# Altium project ADIO_Ver1.2.PrjPCB
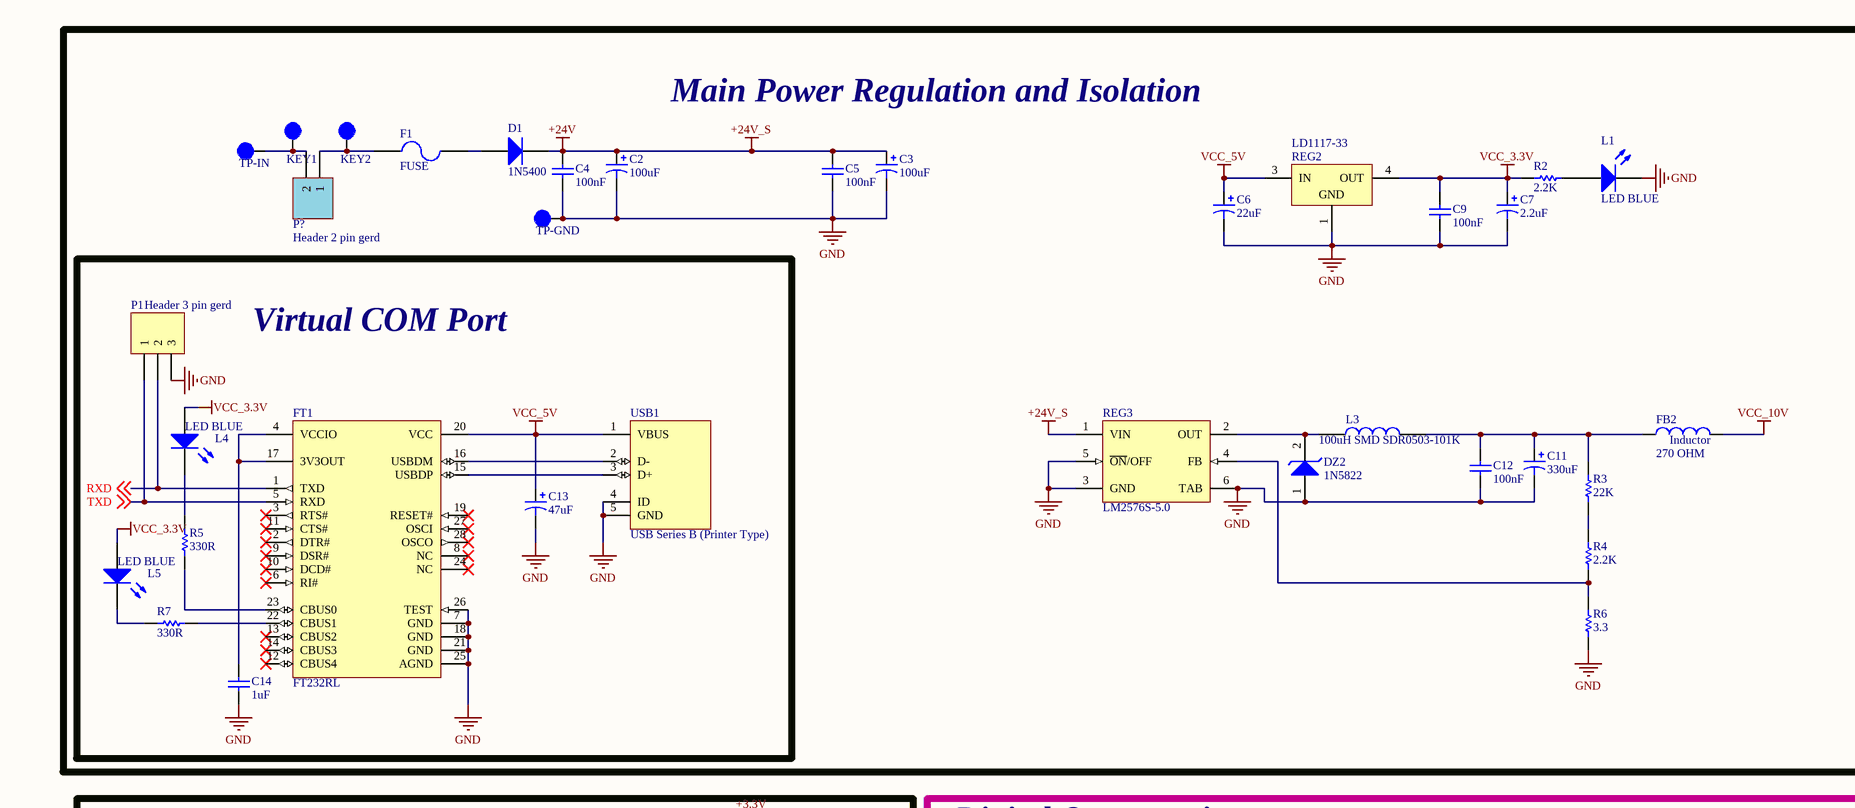
[diagram p0: ADIO_Ver1.2.SchDoc, top left]
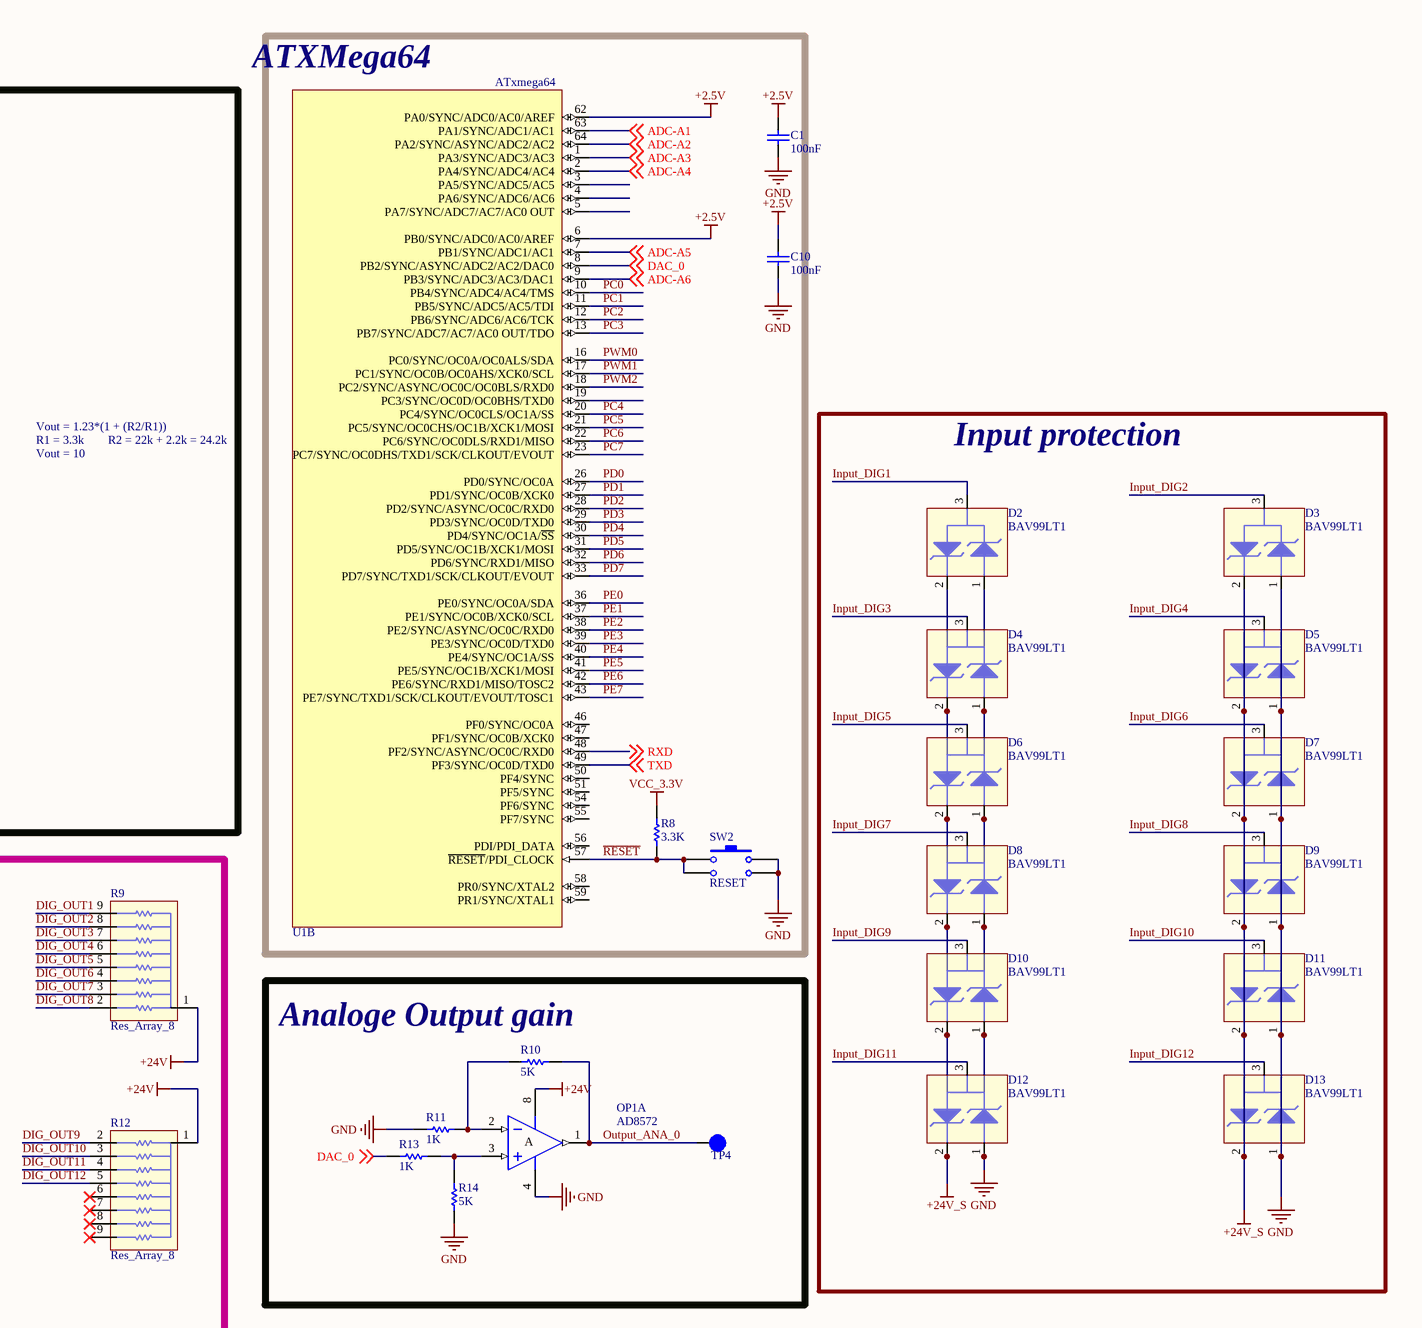
[diagram p1: ADIO_Ver1.2.SchDoc, top right]
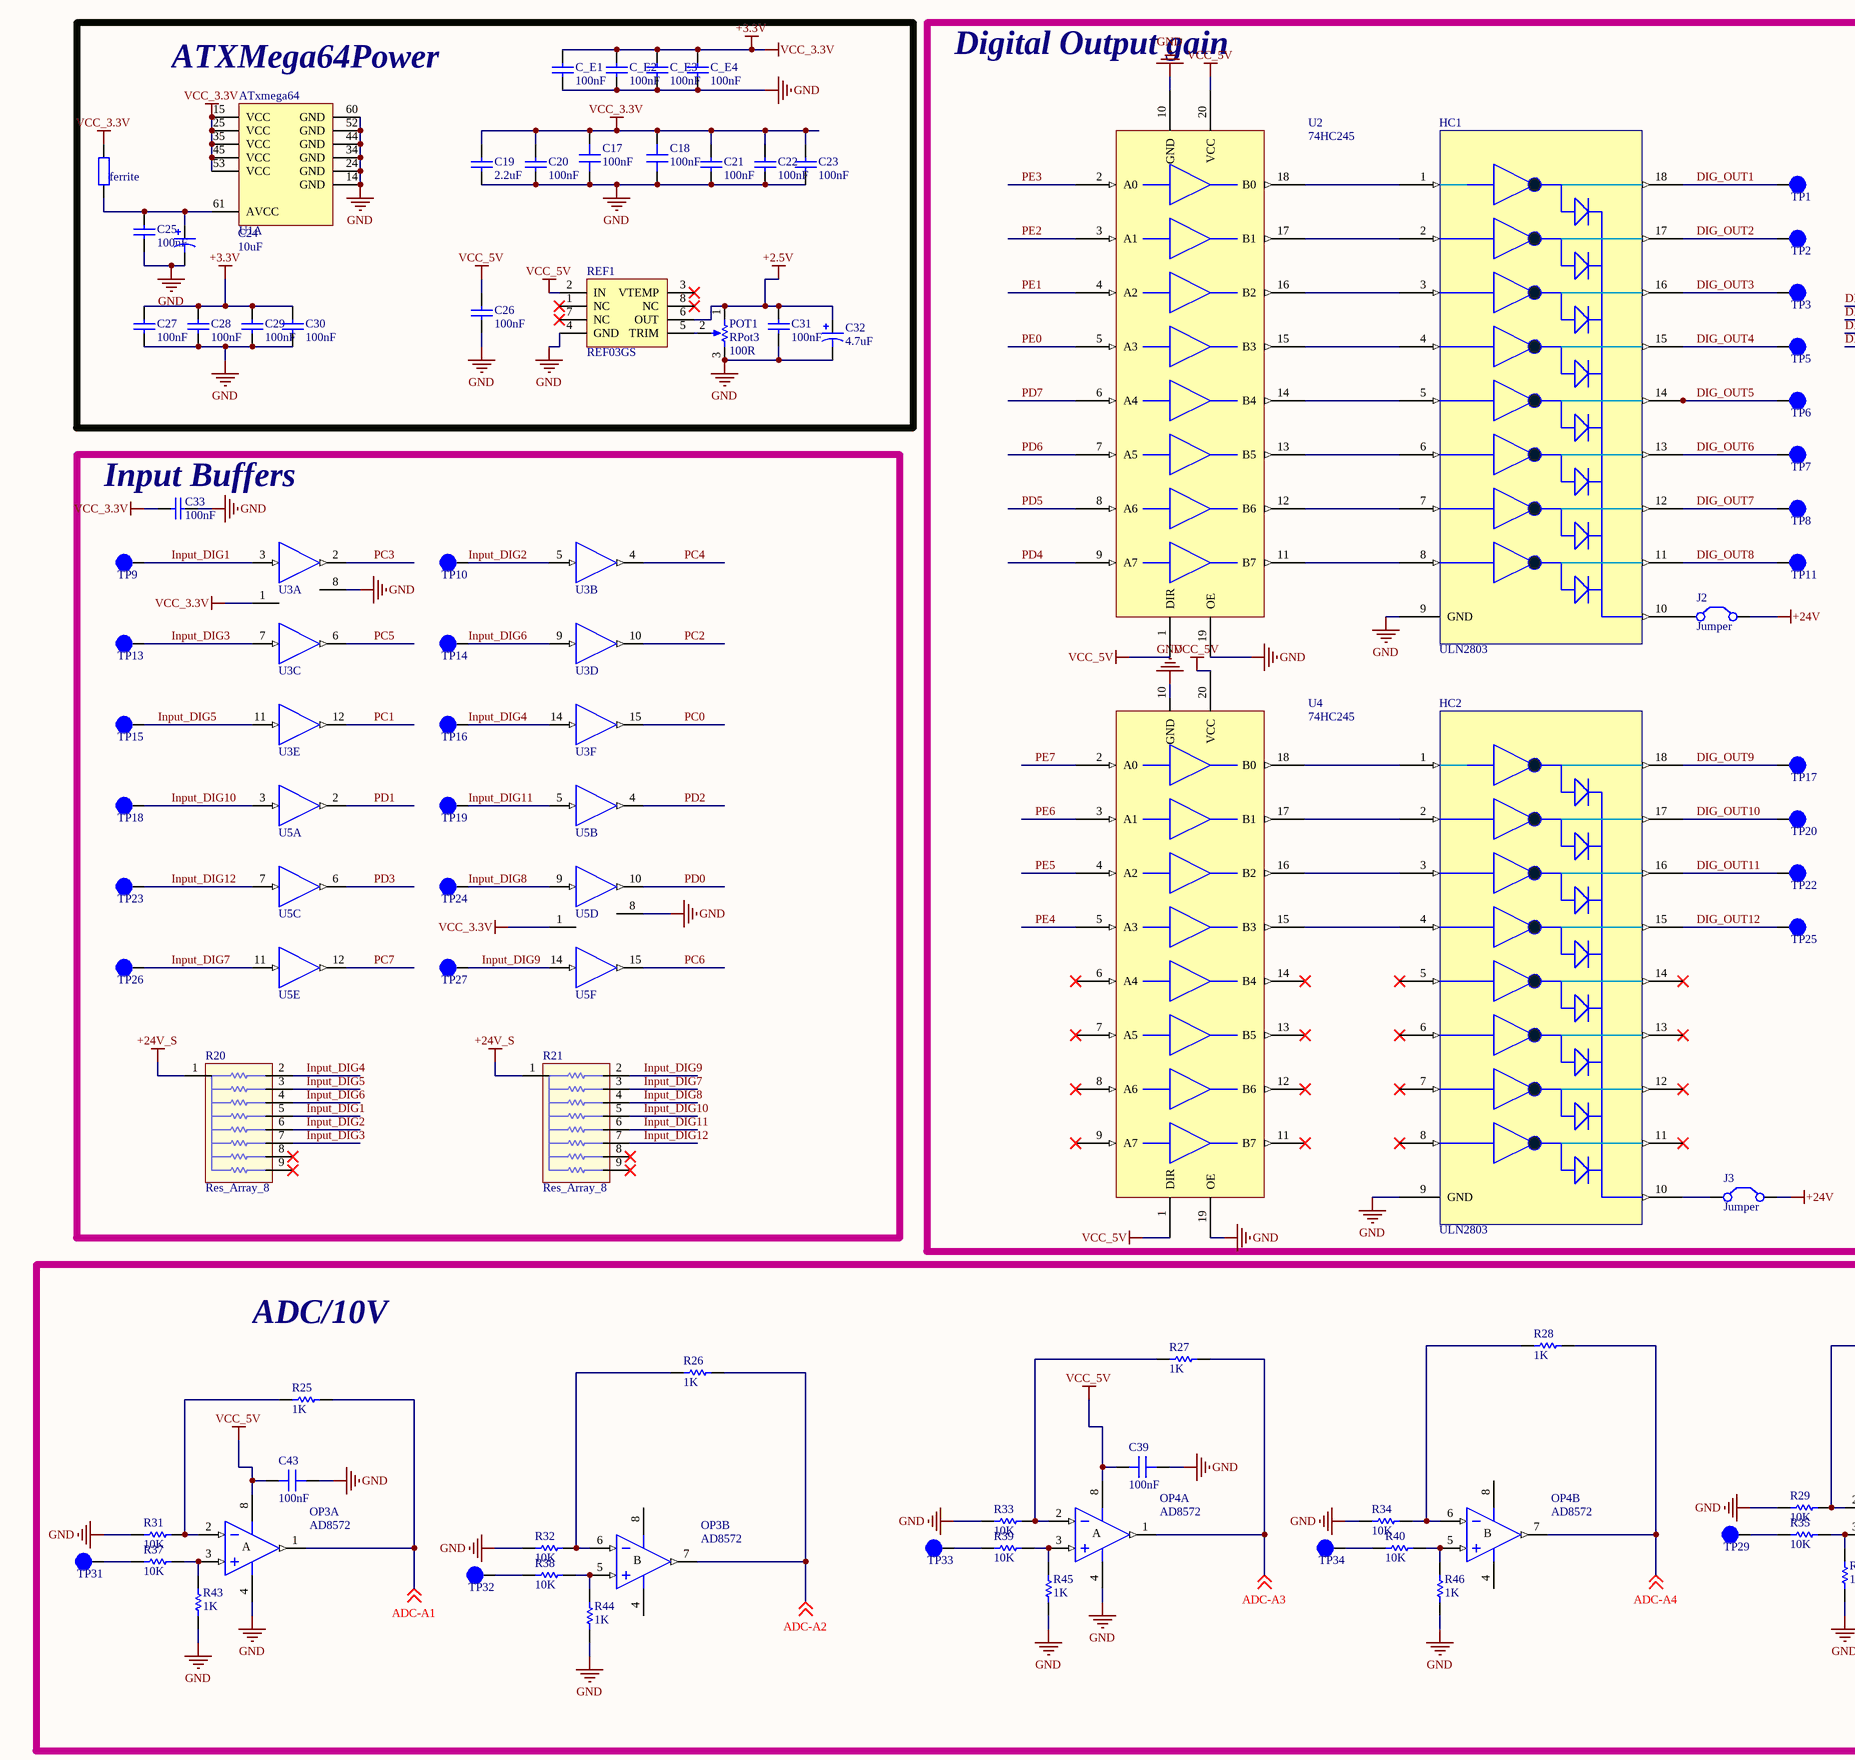
[diagram p2: ADIO_Ver1.2.SchDoc, bottom left]
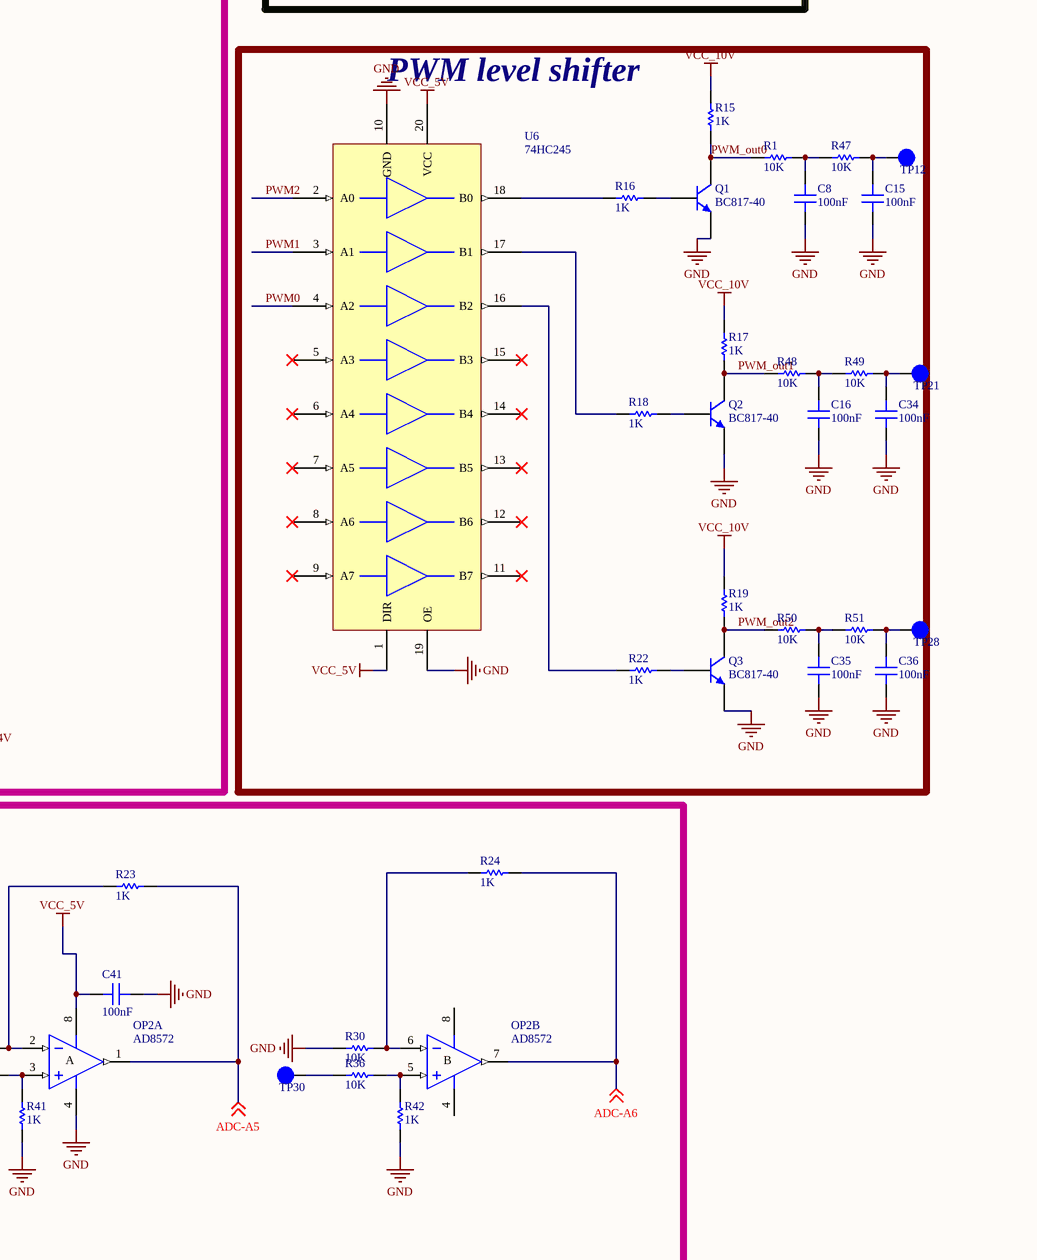
[diagram p3: ADIO_Ver1.2.SchDoc, bottom right]
1 sheet, 179 parts. Net scope: global (net labels, ports and power ports of the same name join across sheets).
Board file: ADIO_Ver1.2.PcbDoc

## Sheet ADIO_Ver1.2.SchDoc
size 635 x 508 mm

### Parts
C1  100nF  [C805]
C2  100uF  [CAP 5x10.5]
C3  100uF  [CAP 5x10.5]
C4  100nF  [C805]
C5  100nF  [C805]
C6  22uF  [CAP 5x10.5]
C7  2.2uF  [CAPMOL-A]
C8  100nF  [C1206]
C9  100nF  [C805]
C10  100nF  [C805]
C11  330uF  [CAP 5x10.5]
C12  100nF  [C805]
C13  47uF  [CAPMOL-B]
C14  1uF  [C805]
C15  100nF  [C1206]
C16  100nF  [C1206]
C17  100nF  [C0805]
C18  100nF  [C0805]
C19  2.2uF  [C805]
C20  100nF  [C805]
C21  100nF  [C805]
C22  100nF  [C805]
C23  100nF  [C805]
C24  10uF  [CAPMOL-B]
C25  100nF  [C805]
C26  100nF  [C805]
C27  100nF  [C805]
C28  100nF  [C805]
C29  100nF  [C805]
C30  100nF  [C805]
C31  100nF  [C805]
C32  4.7uF  [CAPMOL-B]
C33  100nF  [C0805]
C34  100nF  [C1206]
C35  100nF  [C1206]
C36  100nF  [C1206]
C39  100nF  [C0805]
C41  100nF  [C0805]
C43  100nF  [C0805]
C_E1  100nF  [C805]
C_E2  100nF  [C805]
C_E3  100nF  [C805]
C_E4  100nF  [C805]
D1  1N5400  [MDO-201AD]
D2  BAV99LT1  [MSOT-23]
D3  BAV99LT1  [MSOT-23]
D4  BAV99LT1  [MSOT-23]
D5  BAV99LT1  [MSOT-23]
D6  BAV99LT1  [MSOT-23]
D7  BAV99LT1  [MSOT-23]
D8  BAV99LT1  [MSOT-23]
D9  BAV99LT1  [MSOT-23]
D10  BAV99LT1  [MSOT-23]
D11  BAV99LT1  [MSOT-23]
D12  BAV99LT1  [MSOT-23]
D13  BAV99LT1  [MSOT-23]
DZ2  1N5822  [DIODE-SMC]
F1  FUSE  [FUSE_3]
FB2  Inductor  value 270 OHM  [AXIAL-0.3]
FT1  FT232RL  [MSSOP-28]
HC1  ULN2803  [ULN2803]
HC2  ULN2803  [ULN2803]
J2  Jumper  [MRAD-0.1]
J3  Jumper  [MRAD-0.1]
KEY1  VREF  [Test-Pin]  (value not drawn)
KEY2  VREF  [Test-Pin]  (value not drawn)
L1  LED BLUE  [LED 0805]
L3  100uH SMD SDR0503-101K  [Inductor SMD Power 100UH]
L4  LED BLUE  [LED 0805]
L5  LED BLUE  [LED 0805]
OP1  AD8572  [SO8_N]  (part A of 2)
OP2  AD8572  [SO8_N]  (parts A,B of 2)
OP3  AD8572  [SO8_N]  (parts A,B of 2)
OP4  AD8572  [SO8_N]  (parts A,B of 2)
P1  Header 3 pin gerd  [SPOX-3]
P?  Header 2 pin gerd  [SPOX-2]
POT1  RPot3  value 100R  [VR5]
Q1  BC817-40  [MSOT-23]
Q2  BC817-40  [MSOT-23]
Q3  BC817-40  [MSOT-23]
R1  10K  [R0805]
R2  2.2K  [R0805]
R3  22K  [R0805]
R4  2.2K  [R0805]
R5  330R  [R0805]
R6  3.3  [R0805]
R7  330R  [R0805]
R8  3.3K  [R0805]
R9  Res_Array_8  [RES_ARRAY8]
R10  5K  [R0805]
R11  1K  [R0805]
R12  Res_Array_8  [RES_ARRAY8]
R13  1K  [R0805]
R14  5K  [R0805]
R15  1K  [R0805]
R16  1K  [R0805]
R17  1K  [R0805]
R18  1K  [R0805]
R19  1K  [R0805]
R20  Res_Array_8  [RES_ARRAY8]
R21  Res_Array_8  [RES_ARRAY8]
R22  1K  [R0805]
R23  1K  [R0805]
R24  1K  [R0805]
R25  1K  [R0805]
R26  1K  [R0805]
R27  1K  [R0805]
R28  1K  [R0805]
R29  10K  [R0805]
R30  10K  [R0805]
R31  10K  [R0805]
R32  10K  [R0805]
R33  10K  [R0805]
R34  10K  [R0805]
R35  10K  [R0805]
R36  10K  [R0805]
R37  10K  [R0805]
R38  10K  [R0805]
R39  10K  [R0805]
R40  10K  [R0805]
R41  1K  [R0805]
R42  1K  [R0805]
R43  1K  [R0805]
R44  1K  [R0805]
R45  1K  [R0805]
R46  1K  [R0805]
R47  10K  [R0805]
R48  10K  [R0805]
R49  10K  [R0805]
R50  10K  [R0805]
R51  10K  [R0805]
R_ferrit1  value ferrite  [R1206]  (hidden comment: Res2)
REF1  REF03GS  [SO8_N]
REG2  LD1117-33  [MDPAK-TO-252]
REG3  LM2576S-5.0  [MTO-263]
SW2  RESET  [SW_SMD]
TP1  TP_ADIO  [test_point_ADIO]  (value not drawn)
TP2  TP_ADIO  [test_point_ADIO]  (value not drawn)
TP3  TP_ADIO  [test_point_ADIO]  (value not drawn)
TP4  TP_ADIO  [test_point_ADIO]  (value not drawn)
TP5  TP_ADIO  [test_point_ADIO]  (value not drawn)
TP6  TP_ADIO  [test_point_ADIO]  (value not drawn)
TP7  TP_ADIO  [test_point_ADIO]  (value not drawn)
TP8  TP_ADIO  [test_point_ADIO]  (value not drawn)
TP9  TP_ADIO  [test_point_ADIO]  (value not drawn)
TP10  TP_ADIO  [test_point_ADIO]  (value not drawn)
TP11  TP_ADIO  [test_point_ADIO]  (value not drawn)
TP12  TP_ADIO  [test_point_ADIO]  (value not drawn)
TP13  TP_ADIO  [test_point_ADIO]  (value not drawn)
TP14  TP_ADIO  [test_point_ADIO]  (value not drawn)
TP15  TP_ADIO  [test_point_ADIO]  (value not drawn)
TP16  TP_ADIO  [test_point_ADIO]  (value not drawn)
TP17  TP_ADIO  [test_point_ADIO]  (value not drawn)
TP18  TP_ADIO  [test_point_ADIO]  (value not drawn)
TP19  TP_ADIO  [test_point_ADIO]  (value not drawn)
TP20  TP_ADIO  [test_point_ADIO]  (value not drawn)
TP21  TP_ADIO  [test_point_ADIO]  (value not drawn)
TP22  TP_ADIO  [test_point_ADIO]  (value not drawn)
TP23  TP_ADIO  [test_point_ADIO]  (value not drawn)
TP24  TP_ADIO  [test_point_ADIO]  (value not drawn)
TP25  TP_ADIO  [test_point_ADIO]  (value not drawn)
TP26  TP_ADIO  [test_point_ADIO]  (value not drawn)
TP27  TP_ADIO  [test_point_ADIO]  (value not drawn)
TP28  TP_ADIO  [test_point_ADIO]  (value not drawn)
TP29  TP_ADIO  [test_point_ADIO]  (value not drawn)
TP30  TP_ADIO  [test_point_ADIO]  (value not drawn)
TP31  TP_ADIO  [test_point_ADIO]  (value not drawn)
TP32  TP_ADIO  [test_point_ADIO]  (value not drawn)
TP33  TP_ADIO  [test_point_ADIO]  (value not drawn)
TP34  TP_ADIO  [test_point_ADIO]  (value not drawn)
TP-GND  TP_ADIO  [test_point_ADIO]  (value not drawn)
TP-IN  TP_ADIO  [test_point_ADIO]  (value not drawn)
U1  ATxmega64  [MTQFP64]  (parts A,B of 2)
U2  74HC245  [D020_N]
U3  MC74HC4050D  [751B-05_N]  (value not drawn)  (parts A,B,C,D,E,F of 6)
U4  74HC245  [D020_N]
U5  MC74HC4050D  [751B-05_N]  (value not drawn)  (parts A,B,C,D,E,F of 6)
U6  74HC245  [D020_N]
USB1  USB Series B (Printer Type)  [USB-B]

### Blocks framed on the sheet
Main Power Regulation and Isolation: C2-C7 C9 C11 C12 D1 DZ2 F1 FB2 KEY1 KEY2 L1 L3 P? R2-R4 R6 REG2 REG3 TP-GND TP-IN
Virtual COM Port: C13 C14 FT1 L4 L5 P1 R5 R7 USB1
Input protection: D2-D13
ATXMega64Power: C17-C32 C_E1-C_E4 POT1 R_ferrit1 REF1 U1
Digital Output gain: HC1 HC2 J2 J3 R9 R12 TP1-TP3 TP5-TP8 TP11 TP17 TP20 TP22 TP25 U2 U4
Analoge Output gain: OP1 R10 R11 R13 R14 TP4
Input Buffers: C33 R20 R21 TP9 TP10 TP13-TP16 TP18 TP19 TP23 TP24 TP26 TP27 U3 U5
PWM level shifter: C8 C15 C16 C34-C36 Q1-Q3 R1 R15-R19 R22 R47-R51 TP12 TP21 TP28 U6
ADC/10V: C39 C41 C43 OP2-OP4 R23-R46 TP29-TP34

### Nets
+2.5V: C1.2 C10.2 C31.2 C32.1 POT1.1(TOP) REF1.6(OUT) U1.6(PB0/SYNC/ADC0/AC0/AREF) U1.62(PA0/SYNC/ADC0/AC0/AREF)
+3.3V: C7.1 C9.2 C17.2 C18.2 C19.2 C20.2 C21.2 C22.2 C23.2 C27.2 C28.2 C29.2 C30.2 C33.1 C_E1.2 C_E2.2 C_E3.2 C_E4.2 L4.1(A) L5.1(A) R2.1 R8.2 R_ferrit1.2 REG2.4(OUT) U1.15(VCC) U1.25(VCC) U1.35(VCC) U1.45(VCC) U1.53(VCC) U3.1(VDD) U5.1(VDD)  [also labelled VCC_3.3V]
+24V: C2.1 C3.1 C4.2 C5.2 D1.2(K) D2.2 D3.2 D4.2 D5.2 D6.2 D7.2 D8.2 D9.2 D10.2 D11.2 D12.2 D13.2 J2.2(C2) J3.2(C2) OP1.8(V+) R9.1 R12.1 R20.1 R21.1 REG3.1(VIN)  [also labelled +24V_S]
GND: C1.1 C2.2 C3.2 C4.1 C5.1 C6.2 C7.2 C8.1 C9.1 C10.1 C11.2 C12.1 C13.2 C14.1 C15.1 C16.1 C17.1 C18.1 C19.1 C20.1 C21.1 C22.1 C23.1 C24.2 C25.1 C26.1 C27.1 C28.1 C29.1 C30.1 C31.1 C32.2 C33.2 C34.1 C35.1 C36.1 C39.2 C41.2 C43.2 C_E1.1 C_E2.1 C_E3.1 C_E4.1 D2.1 D3.1 D4.1 D5.1 D6.1 D7.1 D8.1 D9.1 D10.1 D11.1 D12.1 D13.1 DZ2.1(A) FT1.7(GND) FT1.18(GND) FT1.21(GND) FT1.25(AGND) FT1.26(TEST) HC1.9(GND) HC2.9(GND) L1.2(K) OP1.4(V-) OP2.4(V-) OP3.4(V-) OP4.4(V-) P1.3 POT1.3(BOT) Q1.2(E) Q2.2(E) Q3.2(E) R6.2 R11.1 R14.1 R29.1 R30.1 R31.1 R32.1 R33.1 R34.1 R41.1 R42.1 R43.1 R44.1 R45.1 R46.1 REF1.4(GND) REG2.1(GND) REG3.3(GND) REG3.5(~{ON}/OFF) REG3.6(TAB) SW2.2 SW2.4 TP-GND.1 U1.14(GND) U1.24(GND) U1.34(GND) U1.44(GND) U1.52(GND) U1.60(GND) U2.10(GND) U2.19(OE) U3.8(GND) U4.19(OE) U5.8(GND) U6.10(GND) U6.19(OE) USB1.4(ID) USB1.5(GND)
VCC_5V: C6.1 C13.1 C26.2 C39.1 C41.1 C43.1 FT1.20(VCC) OP2.8(V+) OP3.8(V+) OP4.8(V+) REF1.2(IN) REG2.3(IN) U2.1(DIR) U2.20(VCC) U4.1(DIR) U4.20(VCC) U6.1(DIR) U6.20(VCC) USB1.1(VBUS)
VCC_10V: FB2.2 R15.1 R17.1 R19.1
ADC-A1: OP3.1(OUT) R25.2 U1.63(PA1/SYNC/ADC1/AC1) ; off-sheet ADC-A1
ADC-A2: OP3.7(OUT) R26.2 U1.64(PA2/SYNC/ASYNC/ADC2/AC2) ; off-sheet ADC-A2
ADC-A3: OP4.1(OUT) R27.2 U1.1(PA3/SYNC/ADC3/AC3) ; off-sheet ADC-A3
ADC-A4: OP4.7(OUT) R28.2 U1.2(PA4/SYNC/ADC4/AC4) ; off-sheet ADC-A4
ADC-A5: OP2.1(OUT) R23.2 U1.7(PB1/SYNC/ADC1/AC1) ; off-sheet ADC-A5
ADC-A6: OP2.7(OUT) R24.2 U1.9(PB3/SYNC/ADC3/AC3/DAC1) ; off-sheet ADC-A6
DAC_0: R13.1 U1.8(PB2/SYNC/ASYNC/ADC2/AC2/DAC0) ; off-sheet DAC_0
DIG_OUT1: HC1.18 R9.9 TP1.1
DIG_OUT2: HC1.17 R9.8 TP2.1
DIG_OUT3: HC1.16 R9.7 TP3.1
DIG_OUT4: HC1.15 R9.6 TP5.1
DIG_OUT5: HC1.14 R9.5 TP6.1
DIG_OUT6: HC1.13 R9.4 TP7.1
DIG_OUT7: HC1.12 R9.3 TP8.1
DIG_OUT8: HC1.11 R9.2 TP11.1
DIG_OUT9: HC2.18 R12.2 TP17.1
DIG_OUT10: HC2.17 R12.3 TP20.1
DIG_OUT11: HC2.16 R12.4 TP22.1
DIG_OUT12: HC2.15 R12.5 TP25.1
Input_DIG1: D2.3 R20.5 TP9.1 U3.3(A)
Input_DIG2: D3.3 R20.6 TP10.1 U3.5(A)
Input_DIG3: D4.3 R20.7 TP13.1 U3.7(A)
Input_DIG4: D5.3 R20.2 TP16.1 U3.14(A)
Input_DIG5: D6.3 R20.3 TP15.1 U3.11(A)
Input_DIG6: D7.3 R20.4 TP14.1 U3.9(A)
Input_DIG7: D8.3 R21.3 TP26.1 U5.11(A)
Input_DIG8: D9.3 R21.4 TP24.1 U5.9(A)
Input_DIG9: D10.3 R21.2 TP27.1 U5.14(A)
Input_DIG10: D11.3 R21.5 TP18.1 U5.3(A)
Input_DIG11: D12.3 R21.6 TP19.1 U5.5(A)
Input_DIG12: D13.3 R21.7 TP23.1 U5.7(A)
Output_ANA_0: OP1.1(OUT) R10.2 TP4.1
PC0: U1.10(PB4/SYNC/ADC4/AC4/TMS) U3.15(Y)
PC1: U1.11(PB5/SYNC/ADC5/AC5/TDI) U3.12(Y)
PC2: U1.12(PB6/SYNC/ADC6/AC6/TCK) U3.10(Y)
PC3: U1.13(PB7/SYNC/ADC7/AC7/AC0_OUT/TDO) U3.2(Y)
PC4: U1.20(PC4/SYNC/OC0CLS/OC1A/SS) U3.4(Y)
PC5: U1.21(PC5/SYNC/OC0CHS/OC1B/XCK1/MOSI) U3.6(Y)
PC6: U1.22(PC6/SYNC/OC0DLS/RXD1/MISO) U5.15(Y)
PC7: U1.23(PC7/SYNC/OC0DHS/TXD1/SCK/CLKOUT/EVOUT) U5.12(Y)
PD0: U1.26(PD0/SYNC/OC0A) U5.10(Y)
PD1: U1.27(PD1/SYNC/OC0B/XCK0) U5.2(Y)
PD2: U1.28(PD2/SYNC/ASYNC/OC0C/RXD0) U5.4(Y)
PD3: U1.29(PD3/SYNC/OC0D/TXD0) U5.6(Y)
PD4: U1.30(PD4/SYNC/OC1A/~{SS}) U2.9(A7)
PD5: U1.31(PD5/SYNC/OC1B/XCK1/MOSI) U2.8(A6)
PD6: U1.32(PD6/SYNC/RXD1/MISO) U2.7(A5)
PD7: U1.33(PD7/SYNC/TXD1/SCK/CLKOUT/EVOUT) U2.6(A4)
PE0: U1.36(PE0/SYNC/OC0A/SDA) U2.5(A3)
PE1: U1.37(PE1/SYNC/OC0B/XCK0/SCL) U2.4(A2)
PE2: U1.38(PE2/SYNC/ASYNC/OC0C/RXD0) U2.3(A1)
PE3: U1.39(PE3/SYNC/OC0D/TXD0) U2.2(A0)
PE4: U1.40(PE4/SYNC/OC1A/SS) U4.5(A3)
PE5: U1.41(PE5/SYNC/OC1B/XCK1/MOSI) U4.4(A2)
PE6: U1.42(PE6/SYNC/RXD1/MISO/TOSC2) U4.3(A1)
PE7: U1.43(PE7/SYNC/TXD1/SCK/CLKOUT/EVOUT/TOSC1) U4.2(A0)
PWM0: U1.16(PC0/SYNC/OC0A/OC0ALS/SDA) U6.4(A2)
PWM1: U1.17(PC1/SYNC/OC0B/OC0AHS/XCK0/SCL) U6.3(A1)
PWM2: U1.18(PC2/SYNC/ASYNC/OC0C/OC0BLS/RXD0) U6.2(A0)
PWM_out0: Q1.3(C) R1.2 R15.2
PWM_out1: Q2.3(C) R17.2 R48.2
PWM_out2: Q3.3(C) R19.2 R50.2
~{RESET}: R8.1 SW2.1 SW2.3 U1.57(~{RESET}/PDI_CLOCK)
RXD: FT1.1(TXD) P1.2 U1.48(PF2/SYNC/ASYNC/OC0C/RXD0) ; off-sheet RXD
TXD: FT1.5(RXD) P1.1 U1.49(PF3/SYNC/OC0D/TXD0) ; off-sheet TXD
NetC8_2: C8.2 R1.1 R47.2
NetC11_1: C11.1 C12.2 FB2.1 L3.2 R3.2
NetC14_2: C14.2 FT1.4(VCCIO) FT1.17(3V3OUT)
NetC15_2: C15.2 R47.1 TP12.1
NetC16_2: C16.2 R48.1 R49.2
NetC24_1: C24.1 C25.2 R_ferrit1.1 U1.61(AVCC)
NetC34_2: C34.2 R49.1 TP21.1
NetC35_2: C35.2 R50.1 R51.2
NetC36_2: C36.2 R51.1 TP28.1
NetD1_1: D1.1(A) F1.2
NetDZ2_2: DZ2.2(K) L3.1 REG3.2(OUT)
NetF1_1: F1.1 KEY2.1 P?.1
NetFT1_15: FT1.15(USBDP) USB1.3(D+)
NetFT1_16: FT1.16(USBDM) USB1.2(D-)
NetFT1_22: FT1.22(CBUS1) R7.1
NetFT1_23: FT1.23(CBUS0) R5.1
NetHC1_1: HC1.1 U2.18(B0)
NetHC1_2: HC1.2 U2.17(B1)
NetHC1_3: HC1.3 U2.16(B2)
NetHC1_4: HC1.4 U2.15(B3)
NetHC1_5: HC1.5 U2.14(B4)
NetHC1_6: HC1.6 U2.13(B5)
NetHC1_7: HC1.7 U2.12(B6)
NetHC1_8: HC1.8 U2.11(B7)
NetHC1_10: HC1.10(COM) J2.1(C1)
NetHC2_1: HC2.1 U4.18(B0)
NetHC2_2: HC2.2 U4.17(B1)
NetHC2_3: HC2.3 U4.16(B2)
NetHC2_4: HC2.4 U4.15(B3)
NetHC2_10: HC2.10(COM) J3.1(C1)
NetKEY1_1: KEY1.1 P?.2 TP-IN.1
NetL1_1: L1.1(A) R2.2
NetL4_2: L4.2(K) R5.2
NetL5_2: L5.2(K) R7.2
NetOP1_2: OP1.2(IN-) R10.1 R11.2
NetOP1_3: OP1.3(IN+) R13.2 R14.2
NetOP2_2: OP2.2(IN-) R23.1 R29.2
NetOP2_3: OP2.3(IN+) R35.2 R41.2
NetOP2_5: OP2.5(IN+) R36.2 R42.2
NetOP2_6: OP2.6(IN-) R24.1 R30.2
NetOP3_2: OP3.2(IN-) R25.1 R31.2
NetOP3_3: OP3.3(IN+) R37.2 R43.2
NetOP3_5: OP3.5(IN+) R38.2 R44.2
NetOP3_6: OP3.6(IN-) R26.1 R32.2
NetOP4_2: OP4.2(IN-) R27.1 R33.2
NetOP4_3: OP4.3(IN+) R39.2 R45.2
NetOP4_5: OP4.5(IN+) R40.2 R46.2
NetOP4_6: OP4.6(IN-) R28.1 R34.2
NetPOT1_2: POT1.2(TAP) REF1.5(TRIM)
NetQ1_1: Q1.1(B) R16.1
NetQ2_1: Q2.1(B) R18.1
NetQ3_1: Q3.1(B) R22.1
NetR3_1: R3.1 R4.2
NetR4_1: R4.1 R6.1 REG3.4(FB)
NetR16_2: R16.2 U6.18(B0)
NetR18_2: R18.2 U6.17(B1)
NetR22_2: R22.2 U6.16(B2)
NetR35_1: R35.1 TP29.1
NetR36_1: R36.1 TP30.1
NetR37_1: R37.1 TP31.1
NetR38_1: R38.1 TP32.1
NetR39_1: R39.1 TP33.1
NetR40_1: R40.1 TP34.1

Not connected (* = marked no-connect by the designer): FT1 2(DTR#)* 3(RTS#)* 6(RI#)* 8(NC)* 9(DSR#)* 10(DCD#)* 11(CTS#)* 12(CBUS4)* 13(CBUS2)* 14(CBUS3)* 19(RESET#)* 24(NC)* 27(OSCI)* 28(OSCO)*; HC2 5* 6* 7* 8* 11* 12* 13* 14*; R12 6* 7* 8* 9*; R20 8* 9*; R21 8* 9*; REF1 1(NC)* 3(VTEMP)* 7(NC)* 8(NC)*; U1 3(PA5/SYNC/ADC5/AC5) 4(PA6/SYNC/ADC6/AC6) 5(PA7/SYNC/ADC7/AC7/AC0_OUT) 19(PC3/SYNC/OC0D/OC0BHS/TXD0) 46(PF0/SYNC/OC0A) 47(PF1/SYNC/OC0B/XCK0) 50(PF4/SYNC) 51(PF5/SYNC) 54(PF6/SYNC) 55(PF7/SYNC) 56(PDI/PDI_DATA) 58(PR0/SYNC/XTAL2) 59(PR1/SYNC/XTAL1); U4 6(A4)* 7(A5)* 8(A6)* 9(A7)* 10(GND) 11(B7)* 12(B6)* 13(B5)* 14(B4)*; U6 5(A3)* 6(A4)* 7(A5)* 8(A6)* 9(A7)* 11(B7)* 12(B6)* 13(B5)* 14(B4)* 15(B3)*

### Notes on the sheet
- ATXMega64
- Vout = 1.23*(1 + (R2/R1))
- R1 = 3.3k        R2 = 22k + 2.2k = 24.2k
- Vout = 10
- (in symbol LM358D, part A) A
- (in symbol LM358D, part B) B

### Library data of the parts
C1 C4 C5 C9 C10 C12 C14 C19-C23 C25-C31 C33 C_E1-C_E4 = CAP NONPOLAR
C2 C3 C6 C7 C11 C13 C24 C32 = CAP BIPOLAR
C8 C15 C16 C34-C36 = Cap_1206: Capacitor
C17 C18 C39 C41 C43 = Cap_0805: Capacitor
D1 = DIODE
D2-D13 = BAV99LT1: DATA LINE PROTECTOR; Designer: Saeed Poorjandaghi
DZ2 = Diode Zener
F1 = FUSE: FUSE 3A
FB2 = Inductor: Code_IEC: 1005; Published: 8-Jun-2000; LatestRevisionDate: 29-May-2009; LatestRevisionNote: IPC-7351 Footprint Added.; PackageReference: 0402-A; Publisher: Altium Limited; PackageDescription: Chip Inductor; Code_JEITA: 0402
FT1 = FT232RL: FT232RL -- USB UART IC
KEY1 KEY2 = Test Point: No PCB Compunent need; Signal: Voltage
L1 L4 L5 = LED
L3 = Inductor: SMD Power Inductor 100UH
OP1-OP4 = LM358D: Zero-Drift, Single-Supply, Rail-to-Rail; Published: 24-Aug-2001; LatestRevisionDate: 13-Apr-2006; LatestRevisionNote: IPC-7351 Footprint Added.; PackageVersion: Dec-2002; PackageReference: SO8; Publisher: Altium Limited; PackageDescription: 8-Pin Small Outline Integrated Circuit 1.27 mm Pitch; Code_JEDEC: MS-012-AA; Code_IPC: SOIC127P600-8; ComponentLink1Description: Manufacturer Link; ComponentLink1URL: http://www.st.com/; ComponentLink2Description: Datasheet; ComponentLink2URL: http://www.st.com/stonline/products/literature/ds/2163/lm358.pdf
P1 = Header 3: Header, 3-Pin; LatestRevisionDate: 17-Jul-2002; LatestRevisionNote: Re-released for DXP Platform.; Publisher: Altium Limited
P? = PinGerd-2: Header, 2-Pin; LatestRevisionDate: 17-Jul-2002; LatestRevisionNote: Re-released for DXP Platform.; Publisher: Altium Limited
POT1 = RPot: Potentiometer; Sim Note: Enter the Resistance value and the set point into parameter fields.; Set Position: 0.5; Published: 8-Jun-2000; LatestRevisionDate: 17-Jul-2002; LatestRevisionNote: Re-released for DXP Platform.; PackageReference: VR5; Publisher: Altium Limited
Q1-Q3 = BC817-40: NPN General Purpose Amplifier; Published: 8-Jun-2000; LatestRevisionDate: 17-Jul-2002; LatestRevisionNote: Re-released for DXP Platform.; DatasheetDocument: 1997; PackageDocument: Sep-1998; PackageReference: SOT-23A; Publisher: Altium Limited; ComponentLink1Description: Manufacturer Link; ComponentLink1URL: http://www.fairchildsemi.com/; ComponentLink2Description: Discontinuation Notice; ComponentLink2URL: http://www.fairchildsemi.com/obsolete/obs.jsp
R1 R8 R10 R11 R13 R14 R23-R51 = Res_0805: Resistor
R2-R7 R15-R19 R22 = RES
R_ferrit1 = Res2: Resistor; Published: 8-Jun-2000; LatestRevisionDate: 17-Jul-2002; LatestRevisionNote: Re-released for DXP Platform.; PackageReference: AXIAL-0.4; Publisher: Altium Limited
REF1 = REF03GS: +2.5V Precision Voltage Reference; Note: Pins 1, 7 and 8 are not connected; Published: 8-Jun-2000; LatestRevisionDate: 13-Apr-2006; LatestRevisionNote: IPC-7351 Footprint Added.; DatasheetVersion: REV. C 1992; PackageVersion: revA; PackageReference: SO-8; Publisher: Altium Limited; PackageDescription: 8-Pin Small Outline Integrated Circuit 1.27 mm Pitch; Code_JEDEC: MS-012-AA; Code_IPC: SOIC127P600-8; ComponentLink1Description: Manufacturer Link; ComponentLink1URL: http://www.analog.com/en/prod/0%2C2877%2CREF03%2C00.html; ComponentLink2Description: Datasheet; ComponentLink2URL: http://www.analog.com/UploadedFiles/Data_Sheets/56211209654177REF03_f.pdf
REG3 = LM2576S-5.0: SIMPLE SWITCHER® 3A Step-Down Voltage Regulator, 5-pin TO-263
SW2 = SW-PB-4Pin: Thin surface mounted micro switch; Designer: Behnam Esckandariun
TP1-TP34 TP-GND TP-IN = TEST_POINT_ADIO
U1 = ATxmega64: Low power, high performance 8/16-bit AVR microcontroller; Creator: Saeed poorjandaghi
U2 U4 U6 = 74HC245: Octal Inverting Tri-State Buffer; FPGAVendor: Altera; Published: 17-Apr-2002; Publisher: Altium Limited
U3 U5 = MC74HC4050D: Hex Non-Inverting Buffer/Logic-Level Down Converter; Note: Pins 13 & 16 are NC and not drawn.; Published: 17-Jul-2002; LatestRevisionDate: 13-Apr-2006; LatestRevisionNote: IPC-7351 Footprint Added.; DatasheetVersion: 1989; PackageVersion: 1991; PackageReference: 751B-03; Publisher: Altium Limited; PackageDescription: 16-Pin Small Outline Integrated Circuit 1.27 mm Pitch; Code_JEDEC: MS-012-AC; Code_IPC: SOIC127P600-16; ComponentLink1Description: Manufacturer Link; ComponentLink1URL: http://www.onsemi.com/site/products/parametrics/0,4446,247,00.html; ComponentLink2Description: Ibis Model; ComponentLink2URL: http://www.onsemi.com/pub/Collateral/MC54HC4049J.IBS
USB1 = USB-B: USB B type Socket